# Altium schematic sheet Board.SchDoc
size 420 x 297 mm; Address1: Address1; Address2: Address2; Address3: Address3; Address4: Address4; DocumentNumber: АБВГ.123456.001 Э3; SheetNumber: 3; SheetTotal: 3; Scale: 1:1; DocumentType: Схема электрическая принципиальная; FirstReferrence: АБВГ.123456.001
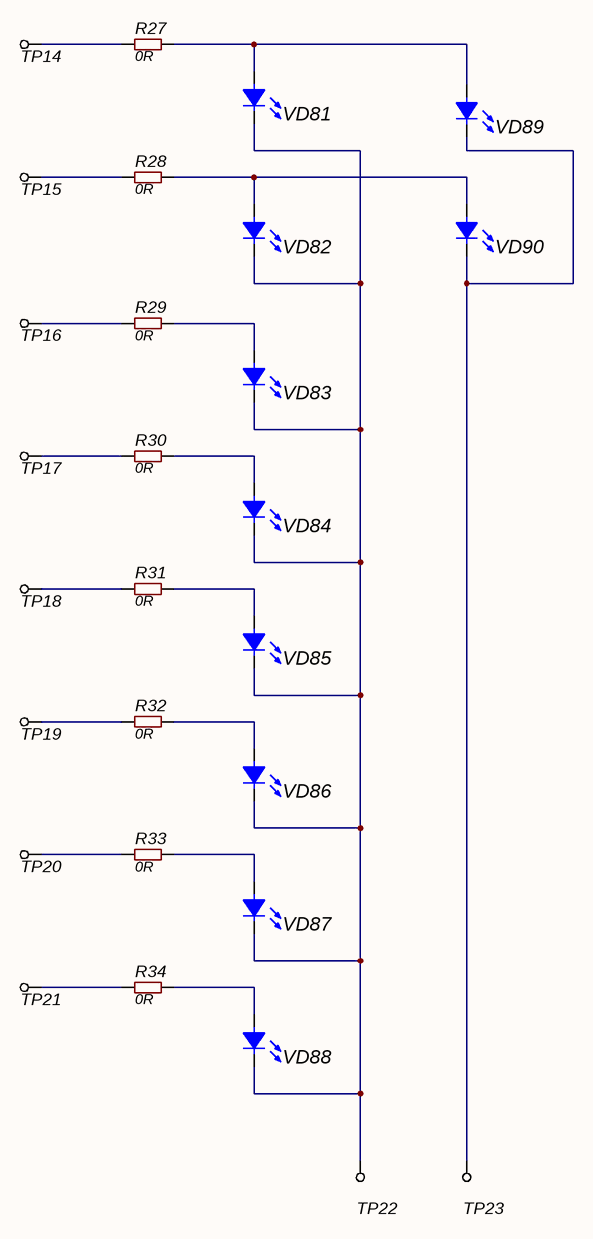
[diagram p0: Board.SchDoc]

## Parts
R27  value 0R  [RES: 0603]
R28  value 0R  [RES: 0603]
R29  value 0R  [RES: 0603]
R30  value 0R  [RES: 0603]
R31  value 0R  [RES: 0603]
R32  value 0R  [RES: 0603]
R33  value 0R  [RES: 0603]
R34  value 0R  [RES: 0603]
TP14  Testpoint_HS1mm  [TestPoint(without 3D)]  (value not drawn)
TP15  Testpoint_HS1mm  [TestPoint(without 3D)]  (value not drawn)
TP16  Testpoint_HS1mm  [TestPoint(without 3D)]  (value not drawn)
TP17  Testpoint_HS1mm  [TestPoint(without 3D)]  (value not drawn)
TP18  Testpoint_HS1mm  [TestPoint(without 3D)]  (value not drawn)
TP19  Testpoint_HS1mm  [TestPoint(without 3D)]  (value not drawn)
TP20  Testpoint_HS1mm  [TestPoint(without 3D)]  (value not drawn)
TP21  Testpoint_HS1mm  [TestPoint(without 3D)]  (value not drawn)
TP22  Testpoint_HS1mm  [TestPoint(without 3D)]  (value not drawn)
TP23  Testpoint_HS1mm  [TestPoint(without 3D)]  (value not drawn)
VD81  (no value)  [LED: 1206Y]
VD82  (no value)  [LED: 1206Y]
VD83  (no value)  [LED: 1206Y]
VD84  (no value)  [LED: 1206Y]
VD85  (no value)  [LED: 1206Y]
VD86  (no value)  [LED: 1206Y]
VD87  (no value)  [LED: 1206Y]
VD88  (no value)  [LED: 1206Y]
VD89  (no value)  [LED: 1206Y]
VD90  (no value)  [LED: 1206Y]

## Nets
NetR27_1: R27.1 TP14.1
NetR27_2: R27.2 VD81.1(A) VD89.1(A)
NetR28_1: R28.1 TP15.1
NetR28_2: R28.2 VD82.1(A) VD90.1(A)
NetR29_1: R29.1 TP16.1
NetR29_2: R29.2 VD83.1(A)
NetR30_1: R30.1 TP17.1
NetR30_2: R30.2 VD84.1(A)
NetR31_1: R31.1 TP18.1
NetR31_2: R31.2 VD85.1(A)
NetR32_1: R32.1 TP19.1
NetR32_2: R32.2 VD86.1(A)
NetR33_1: R33.1 TP20.1
NetR33_2: R33.2 VD87.1(A)
NetR34_1: R34.1 TP21.1
NetR34_2: R34.2 VD88.1(A)
NetTP22_1: TP22.1 VD81.2(C) VD82.2(C) VD83.2(C) VD84.2(C) VD85.2(C) VD86.2(C) VD87.2(C) VD88.2(C)
NetTP23_1: TP23.1 VD89.2(C) VD90.2(C)

## Notes on the sheet
- Перв. примен.
- Справ. №
- Подп. и дата
- Инв. № дубл.
- Взам. инв. №
- Разраб.
- Изм.
- Лист
- № докум.
- Подп.
- Дата
- Лит.
- Масса
- Масштаб
- Пров.
- Т.контр.
- Листов
- Инв. № подл.
- Утв.
- Н.контр.
- 2.106-A3
- Копировал
- Формат А3

## Library data of the parts
R27-R34 = Resistor_0603: Manufacturer: Yageo; PartNumber: RC0603JR-07100RL; TypeResistor: Resistor film; Power: 0.1W; Package: 0603; HelpURL: https://www.digikey.com/product-detail/en/yageo/RC0603JR-07100RL/311-100GRCT-ND/729644; ValueManufacturerPartNumber: =TypeResistor+', '+Value+', '+Tolerance+', '+Package+', '+Power+', '+Temperature; Temperature: -55...+125°C
VD81-VD90 = LED_single: ValueManufacturerPartNumber: LED, Green, *, *, *, -55...+150°C; TypeDiode: LED; ColorParameter: Green; Manufacturer: *; Package: *; HelpURL: *; Temperature: -55...+150°C; Current: *; VoltageDrop: *; PartNumber: *; Color: GREEN